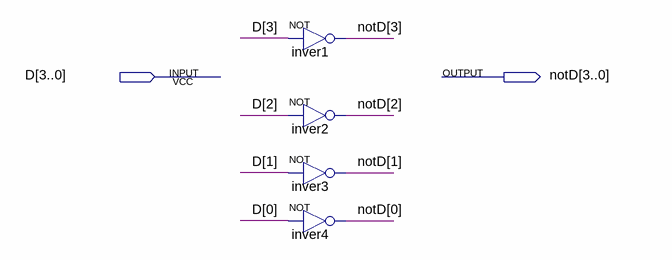
[diagram p0: schematic sheet]
// Quartus schematic Comp4.bdf as structural Verilog: 4 symbols, 2 pins
module Comp4 (
  input  [3:0] D,
  output [3:0] notD
);

  not inver1 (notD[3], D[3]);
  not inver2 (notD[2], D[2]);
  not inver3 (notD[1], D[1]);
  not inver4 (notD[0], D[0]);
endmodule
